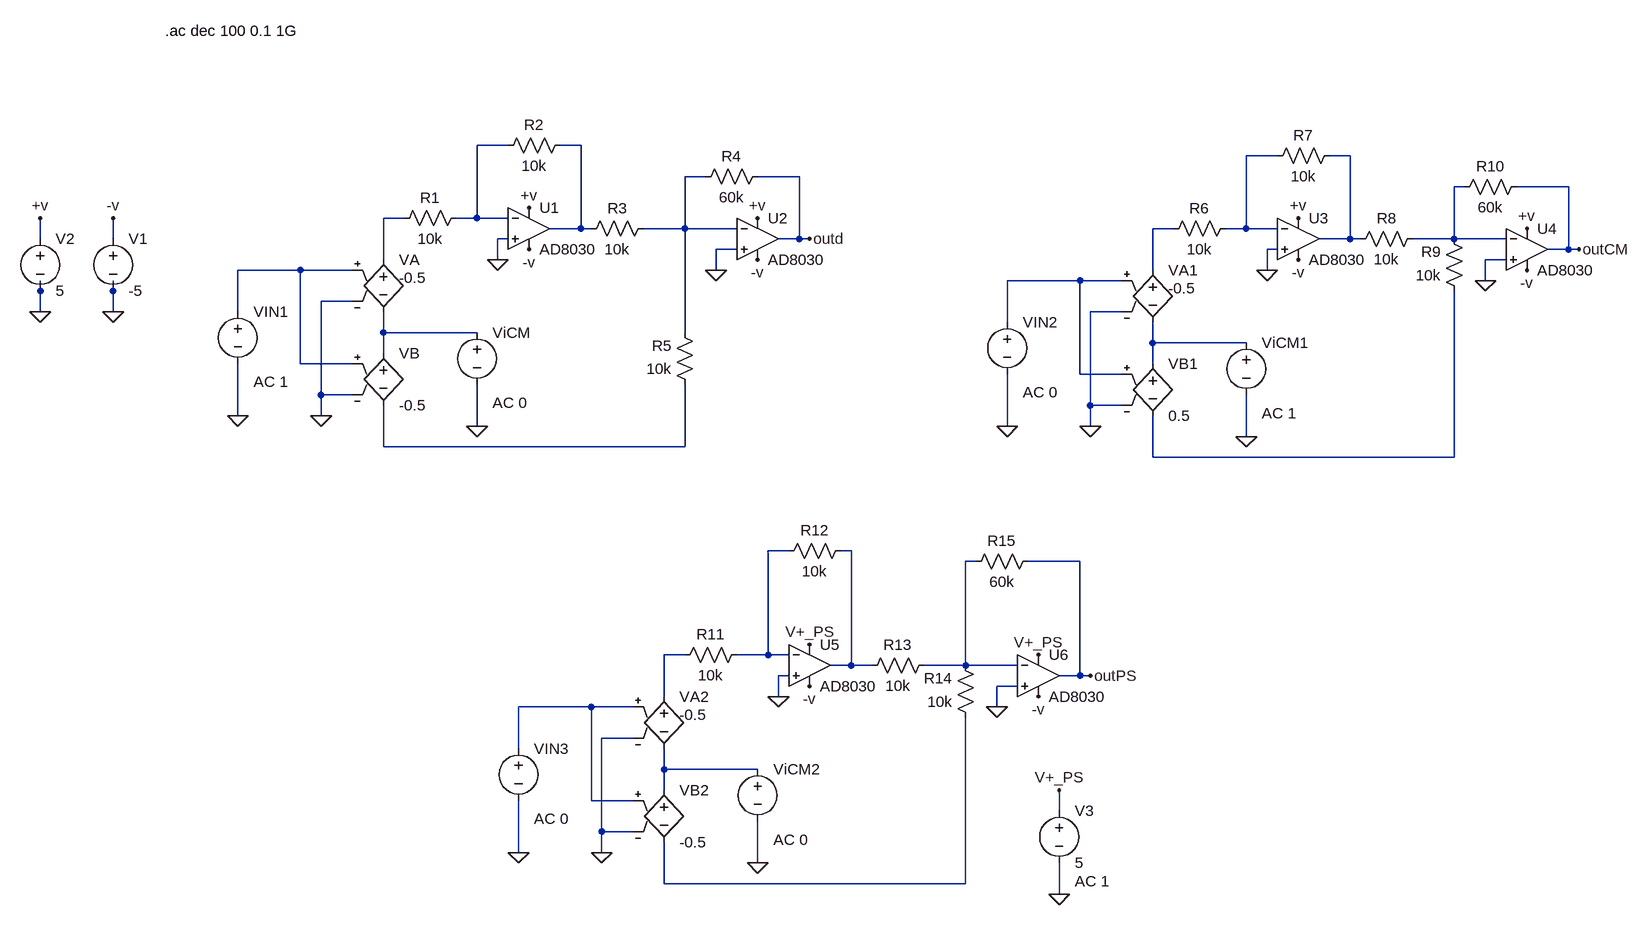
[diagram p0: schematic A0Instrumentatie_Av_BW_CMRR_PSRR.asc]
A0Instrumentatie_Av_BW_CMRR_PSRR.asc, the LTspice schematic file:
Version 4.1
SHEET 1 1660 1844
WIRE -80 32 -128 32
WIRE 32 32 0 32
WIRE 1104 48 1056 48
WIRE 1216 48 1184 48
WIRE 224 80 192 80
WIRE 368 80 304 80
WIRE 1392 96 1376 96
WIRE 1552 96 1472 96
WIRE -240 144 -272 144
WIRE -128 144 -128 32
WIRE -128 144 -160 144
WIRE -80 144 -128 144
WIRE 32 160 32 32
WIRE 32 160 -16 160
WIRE 48 160 32 160
WIRE 192 160 192 80
WIRE 192 160 128 160
WIRE 272 160 192 160
WIRE 944 160 912 160
WIRE 1056 160 1056 48
WIRE 1056 160 1024 160
WIRE 1104 160 1056 160
WIRE -800 176 -800 144
WIRE -688 176 -688 144
WIRE -80 176 -96 176
WIRE 368 176 368 80
WIRE 368 176 336 176
WIRE 384 176 368 176
WIRE 1216 176 1216 48
WIRE 1216 176 1168 176
WIRE 1232 176 1216 176
WIRE 1376 176 1376 96
WIRE 1376 176 1312 176
WIRE 1456 176 1376 176
WIRE 272 192 240 192
WIRE 1104 192 1088 192
WIRE 1552 192 1552 96
WIRE 1552 192 1520 192
WIRE 1568 192 1552 192
WIRE -272 208 -272 144
WIRE -96 208 -96 176
WIRE 1456 208 1424 208
WIRE -400 224 -496 224
WIRE -320 224 -400 224
WIRE 240 224 240 192
WIRE 912 224 912 160
WIRE 1088 224 1088 192
WIRE 800 240 688 240
WIRE 864 240 800 240
WIRE 1424 240 1424 208
WIRE -800 256 -800 240
WIRE -688 256 -688 240
WIRE -320 272 -368 272
WIRE -800 288 -800 256
WIRE -688 288 -688 256
WIRE -496 288 -496 224
WIRE 864 288 816 288
WIRE 688 304 688 240
WIRE -272 320 -272 288
WIRE -128 320 -272 320
WIRE 192 320 192 160
WIRE 912 336 912 304
WIRE 1056 336 912 336
WIRE -272 352 -272 320
WIRE -400 368 -400 224
WIRE -320 368 -400 368
WIRE 912 368 912 336
WIRE 800 384 800 240
WIRE 864 384 800 384
WIRE -368 416 -368 272
WIRE -320 416 -368 416
WIRE 816 432 816 288
WIRE 864 432 816 432
WIRE -496 448 -496 368
WIRE -368 448 -368 416
WIRE -128 464 -128 400
WIRE 688 464 688 384
WIRE 816 464 816 432
WIRE 1056 480 1056 416
WIRE -272 496 -272 432
WIRE 192 496 192 400
WIRE 192 496 -272 496
WIRE 912 512 912 448
WIRE 1376 512 1376 256
WIRE 1376 512 912 512
WIRE 352 656 320 656
WIRE 448 656 432 656
WIRE 640 672 624 672
WIRE 800 672 720 672
WIRE 192 816 160 816
WIRE 320 816 320 656
WIRE 320 816 272 816
WIRE 352 816 320 816
WIRE 448 832 448 656
WIRE 448 832 416 832
WIRE 480 832 448 832
WIRE 624 832 624 672
WIRE 624 832 560 832
WIRE 704 832 624 832
WIRE 352 848 336 848
WIRE 800 848 800 672
WIRE 800 848 768 848
WIRE 816 848 800 848
WIRE 704 864 672 864
WIRE 160 880 160 816
WIRE 336 880 336 848
WIRE 48 896 -64 896
WIRE 112 896 48 896
WIRE 672 896 672 864
WIRE 112 944 64 944
WIRE -64 960 -64 896
WIRE 160 992 160 960
WIRE 304 992 160 992
WIRE 160 1024 160 992
WIRE 48 1040 48 896
WIRE 112 1040 48 1040
WIRE 768 1056 768 1024
WIRE 64 1088 64 944
WIRE 112 1088 64 1088
WIRE -64 1120 -64 1040
WIRE 64 1120 64 1088
WIRE 304 1136 304 1072
WIRE 160 1168 160 1104
WIRE 624 1168 624 912
WIRE 624 1168 160 1168
WIRE 768 1184 768 1136
FLAG 240 224 0
FLAG -96 208 0
FLAG -688 288 0
FLAG -800 288 0
FLAG -800 144 +v
FLAG -688 144 -v
FLAG -48 128 +v
FLAG 304 144 +v
FLAG -48 192 -v
FLAG 304 208 -v
FLAG 384 176 outd
FLAG -368 448 0
FLAG -496 448 0
FLAG -128 464 0
FLAG 1424 240 0
FLAG 1088 224 0
FLAG 1136 144 +v
FLAG 1488 160 +v
FLAG 1136 208 -v
FLAG 1488 224 -v
FLAG 1568 192 outCM
FLAG 816 464 0
FLAG 688 464 0
FLAG 1056 480 0
FLAG 672 896 0
FLAG 336 880 0
FLAG 384 864 -v
FLAG 736 880 -v
FLAG 816 848 outPS
FLAG 64 1120 0
FLAG -64 1120 0
FLAG 304 1136 0
FLAG 768 1184 0
FLAG 768 1024 V+_PS
FLAG 384 800 V+_PS
FLAG 736 816 V+_PS
SYMBOL res -144 128 R90
WINDOW 0 0 56 VBottom 2
WINDOW 3 32 56 VTop 2
SYMATTR InstName R1
SYMATTR Value 10k
SYMBOL res 16 16 R90
WINDOW 0 0 56 VBottom 2
WINDOW 3 32 56 VTop 2
SYMATTR InstName R2
SYMATTR Value 10k
SYMBOL res 144 144 R90
WINDOW 0 0 56 VBottom 2
WINDOW 3 32 56 VTop 2
SYMATTR InstName R3
SYMATTR Value 10k
SYMBOL res 208 96 R270
WINDOW 0 32 56 VTop 2
WINDOW 3 0 56 VBottom 2
SYMATTR InstName R4
SYMATTR Value 60k
SYMBOL res 208 416 R180
WINDOW 0 36 76 Left 2
WINDOW 3 36 40 Left 2
SYMATTR InstName R5
SYMATTR Value 10k
SYMBOL voltage -800 160 R0
WINDOW 123 0 0 Left 0
WINDOW 39 0 0 Left 0
SYMATTR InstName V2
SYMATTR Value 5
SYMBOL voltage -688 160 R0
WINDOW 123 0 0 Left 0
WINDOW 39 0 0 Left 0
SYMATTR InstName V1
SYMATTR Value -5
SYMBOL voltage -496 272 R0
WINDOW 123 24 124 Left 2
WINDOW 39 0 0 Left 0
WINDOW 3 24 44 Left 2
SYMATTR Value2 AC 1
SYMATTR Value ""
SYMATTR InstName VIN1
SYMBOL e -272 336 R0
SYMATTR InstName VB
SYMATTR Value -0.5
SYMBOL e -272 192 R0
WINDOW 3 24 44 Left 2
SYMATTR Value -0.5
SYMATTR InstName VA
SYMBOL voltage -128 304 R0
WINDOW 123 24 124 Left 2
WINDOW 39 0 0 Left 0
SYMATTR Value2 AC 0
SYMATTR InstName ViCM
SYMATTR Value ""
SYMBOL OpAmps\\AD8030 1136 112 R0
SYMATTR InstName U3
SYMBOL OpAmps\\AD8030 1488 128 R0
SYMATTR InstName U4
SYMBOL res 1040 144 R90
WINDOW 0 0 56 VBottom 2
WINDOW 3 32 56 VTop 2
SYMATTR InstName R6
SYMATTR Value 10k
SYMBOL res 1200 32 R90
WINDOW 0 0 56 VBottom 2
WINDOW 3 32 56 VTop 2
SYMATTR InstName R7
SYMATTR Value 10k
SYMBOL res 1328 160 R90
WINDOW 0 0 56 VBottom 2
WINDOW 3 32 56 VTop 2
SYMATTR InstName R8
SYMATTR Value 10k
SYMBOL res 1392 272 R180
WINDOW 0 36 76 Left 2
WINDOW 3 36 40 Left 2
SYMATTR InstName R9
SYMATTR Value 10k
SYMBOL res 1488 80 R90
WINDOW 0 0 56 VBottom 2
WINDOW 3 32 56 VTop 2
SYMATTR InstName R10
SYMATTR Value 60k
SYMBOL voltage 688 288 R0
WINDOW 123 24 124 Left 2
WINDOW 39 0 0 Left 0
SYMATTR Value2 AC 0
SYMATTR InstName VIN2
SYMATTR Value ""
SYMBOL e 912 352 R0
SYMATTR InstName VB1
SYMATTR Value 0.5
SYMBOL e 912 208 R0
WINDOW 3 24 44 Left 2
SYMATTR Value -0.5
SYMATTR InstName VA1
SYMBOL voltage 1056 320 R0
WINDOW 123 24 124 Left 2
WINDOW 39 0 0 Left 0
SYMATTR Value2 AC 1
SYMATTR InstName ViCM1
SYMATTR Value ""
SYMBOL OpAmps\\AD8030 384 768 R0
SYMATTR InstName U5
SYMBOL OpAmps\\AD8030 736 784 R0
SYMATTR InstName U6
SYMBOL res 288 800 R90
WINDOW 0 0 56 VBottom 2
WINDOW 3 32 56 VTop 2
SYMATTR InstName R11
SYMATTR Value 10k
SYMBOL res 448 640 R90
WINDOW 0 0 56 VBottom 2
WINDOW 3 32 56 VTop 2
SYMATTR InstName R12
SYMATTR Value 10k
SYMBOL res 576 816 R90
WINDOW 0 0 56 VBottom 2
WINDOW 3 32 56 VTop 2
SYMATTR InstName R13
SYMATTR Value 10k
SYMBOL res 640 928 R180
WINDOW 0 36 76 Left 2
WINDOW 3 36 40 Left 2
SYMATTR InstName R14
SYMATTR Value 10k
SYMBOL res 736 656 R90
WINDOW 0 0 56 VBottom 2
WINDOW 3 32 56 VTop 2
SYMATTR InstName R15
SYMATTR Value 60k
SYMBOL voltage -64 944 R0
WINDOW 123 24 124 Left 2
WINDOW 39 0 0 Left 0
SYMATTR Value2 AC 0
SYMATTR InstName VIN3
SYMATTR Value ""
SYMBOL e 160 1008 R0
SYMATTR InstName VB2
SYMATTR Value -0.5
SYMBOL e 160 864 R0
WINDOW 3 24 44 Left 2
SYMATTR Value -0.5
SYMATTR InstName VA2
SYMBOL voltage 304 976 R0
WINDOW 123 24 124 Left 2
WINDOW 39 0 0 Left 0
SYMATTR Value2 AC 0
SYMATTR InstName ViCM2
SYMATTR Value ""
SYMBOL voltage 768 1040 R0
WINDOW 123 24 124 Left 2
WINDOW 39 0 0 Left 0
SYMATTR Value2 AC 1
SYMATTR InstName V3
SYMATTR Value 5
SYMBOL OpAmps\\AD8030 -48 96 R0
SYMATTR InstName U1
SYMBOL OpAmps\\AD8030 304 112 R0
SYMATTR InstName U2
TEXT -608 -144 Left 2 !.ac dec 100 0.1 1G

The netlist it stands for:
* A0Instrumentatie_Av_BW_CMRR_PSRR.asc
R1 N001 N007 10k
R2 N002 N001 10k
R3 N005 N002 10k
R4 N005 outd 60k
R5 N013 N005 10k
V2 +v 0 5
V1 -v 0 -5
VIN1 N009 0 AC 1
E§VB N011 N013 N009 0 -0.5
E§VA N007 N011 N009 0 -0.5
ViCM N011 0 AC 0
X§U3 0 N003 +v -v N004 AD8040  ; AD8030, pins In+ In- V+ V- OUT
X§U4 0 N006 +v -v outCM AD8040  ; AD8030, pins In+ In- V+ V- OUT
R6 N003 N008 10k
R7 N004 N003 10k
R8 N006 N004 10k
R9 N014 N006 10k
R10 outCM N006 60k
VIN2 N010 0 AC 0
E§VB1 N012 N014 N010 0 0.5
E§VA1 N008 N012 N010 0 -0.5
ViCM1 N012 0 AC 1
X§U5 0 N015 V+_PS -v N016 AD8040  ; AD8030, pins In+ In- V+ V- OUT
X§U6 0 N017 V+_PS -v outPS AD8040  ; AD8030, pins In+ In- V+ V- OUT
R11 N015 N018 10k
R12 N016 N015 10k
R13 N017 N016 10k
R14 N021 N017 10k
R15 outPS N017 60k
VIN3 N019 0 AC 0
E§VB2 N020 N021 N019 0 -0.5
E§VA2 N018 N020 N019 0 -0.5
ViCM2 N020 0 AC 0
V3 V+_PS 0 5 AC 1
X§U1 0 N001 +v -v N002 AD8040  ; AD8030, pins In+ In- V+ V- OUT
X§U2 0 N005 +v -v outd AD8040  ; AD8030, pins In+ In- V+ V- OUT
.ac dec 100 0.1 1G
.lib ADI.lib
.backanno
.end